# Altium schematic sheet oring_circuit.SchDoc
size Letter
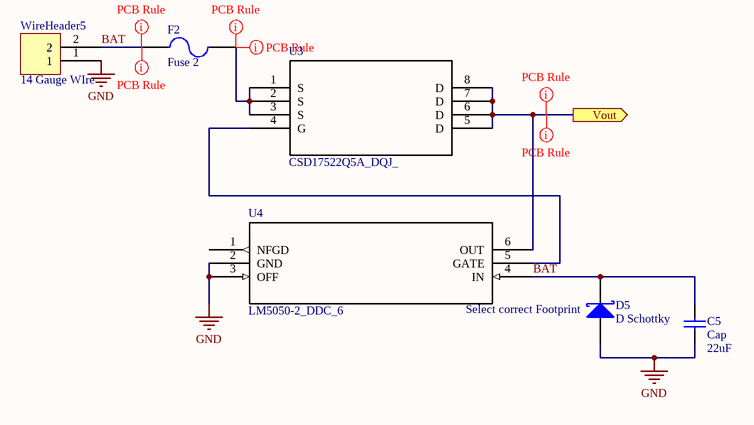
[diagram p0: oring_circuit.SchDoc]

## Parts
C5  Cap  value 22uF  [C0805]
D5  D Schottky  [AXIAL-0.3]
F2  Fuse 2  [PIN-W2/E2.8]
U3  CSD17522Q5A_DQJ_  [DQJ8]
U4  LM5050-2_DDC_6  [MK06A]
WireHeader5  14 Gauge WIre  [WireHeader]

## Ports
Vout (out)

## Nets
GND: C5.1 D5.1(A) U4.2(GND) U4.3(OFF) WireHeader5.1
BAT: C5.2 D5.2(K) F2.1 U4.4(IN) WireHeader5.2
Vout: U3.5(D) U3.6(D) U3.7(D) U3.8(D) U4.6(OUT) ; port Vout
NetF2_2: F2.2 U3.1(S) U3.2(S) U3.3(S)
NetU3_4: U3.4(G) U4.5(GATE)

Not connected (* = marked no-connect by the designer): U4 1(NFGD)

## Layout directives
rule Width Constraint [Pref Width = 40mil    Min Width = 40mil    Max Width = 40mil]: BAT, NetF2_2, Vout
rule Undefined; rule Clearance Constraint [Clearance = 30mil]: BAT, NetF2_2, Vout

## Notes on the sheet
- (near D5) Select correct Footprint

## Library data of the parts
C5 = Cap: Capacitor; Published: 8-Jun-2000; LatestRevisionDate: 17-Jul-2002; LatestRevisionNote: Re-released for DXP Platform.; PackageReference: RAD-0.3; Publisher: Altium Limited; PackageDescription: Radial Cap, Thru-Hole; 2 Leads; 0.3 in Pin Spacing
D5 = D Schottky: Schottky Diode; Published: 8-Jun-2000; LatestRevisionDate: 17-Jul-2002; LatestRevisionNote: Re-released for DXP Platform.; PackageReference: SMB; Publisher: Altium Limited; PackageDescription: DO-214-AA/SMB; 2 C-Bend Leads; Body 5.3 x 3.6 mm, inc. leads (LxW); Code_JEDEC: DO-214-AA
F2 = Fuse 2: Fuse; Published: 8-Jun-2000; LatestRevisionDate: 17-Jul-2002; LatestRevisionNote: Re-released for DXP Platform.; PackageReference: PIN-W2/E2.8; Publisher: Altium Limited; PackageDescription: Thru-Hole; 2 Leads
U3 = CSD17522Q5A_DQJ_: Imported; Manufacturer: Texas Instruments; INDUSTRY_STD_PKG_TYPE: SON; FAMILY_NAME: N-Channel MOSFET Transistors; PIN_COUNT: 8; PACKAGE_DESIGNATOR: DQJ; Datasheet URL: http://www.ti.com/lit/gpn/CSD17522Q5A; GENERIC_PART_NUMBER: CSD17522Q5A; RefDes: RefDes; Type: DEV; Value: Value
U4 = LM5050-2_DDC_6: Imported; Manufacturer: Texas Instruments; DatasheetURL: http://www.ti.com/lit/ds/symlink/lm5050-2.pdf; basePN: LM5050-2; NSC_PackageReference: MK06A; Manufacturer_Part_Number: lm5050-2_ddc_6; Vendor: Texas Instruments; RefDes: RefDes; Type: DEV; Value: Value
WireHeader5 = WireHeader